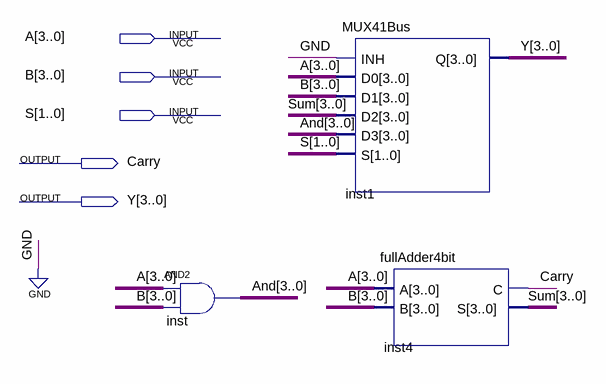
[diagram p0: schematic sheet]
// Quartus schematic ALU.bdf as structural Verilog: 3 symbols, 5 pins
module ALU (
  input  [3:0] A,
  input  [3:0] B,
  input  [1:0] S,
  output Carry,
  output [3:0] Y
);

  wire [3:0] And, Sum;

  assign And = A & B;  // AND2 inst, 4 bits wide
  MUX41Bus inst1 (.INH(1'b0), .D0(A), .D1(B), .D2(Sum), .D3(And), .S(S), .Q(Y));
  fullAdder4bit inst4 (.A(A), .B(B), .C(Carry), .S(Sum));
endmodule
